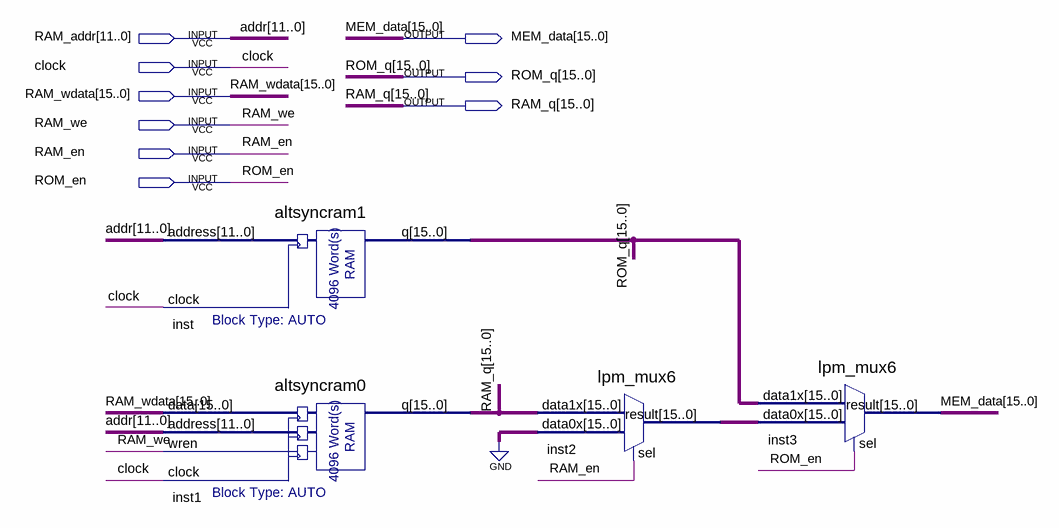
[diagram p0: schematic sheet]
// Quartus schematic memory_unit.bdf as structural Verilog: 4 symbols, 9 pins
module memory_unit (
  input  [11:0] RAM_addr,
  input  clock,
  input  [15:0] RAM_wdata,
  input  RAM_we,
  input  RAM_en,
  input  ROM_en,
  output [15:0] MEM_data,
  output [15:0] ROM_q,
  output [15:0] RAM_q
);

  wire [15:0] inst2_result;

  altsyncram1 inst (.address(RAM_addr), .clock(clock), .q(ROM_q));
  altsyncram0 inst1 (.data(RAM_wdata), .address(RAM_addr), .wren(RAM_we), .clock(clock), .q(RAM_q));
  lpm_mux6 inst2 (.data1x(RAM_q), .data0x({16{1'b0}}), .sel(RAM_en), .result(inst2_result));
  lpm_mux6 inst3 (.data1x(ROM_q), .data0x(inst2_result), .sel(ROM_en), .result(MEM_data));

  // Other names for the same wires on the sheet: addr[11:0] = RAM_addr
endmodule
